# Altium project EECE8010_Template.PrjPcb
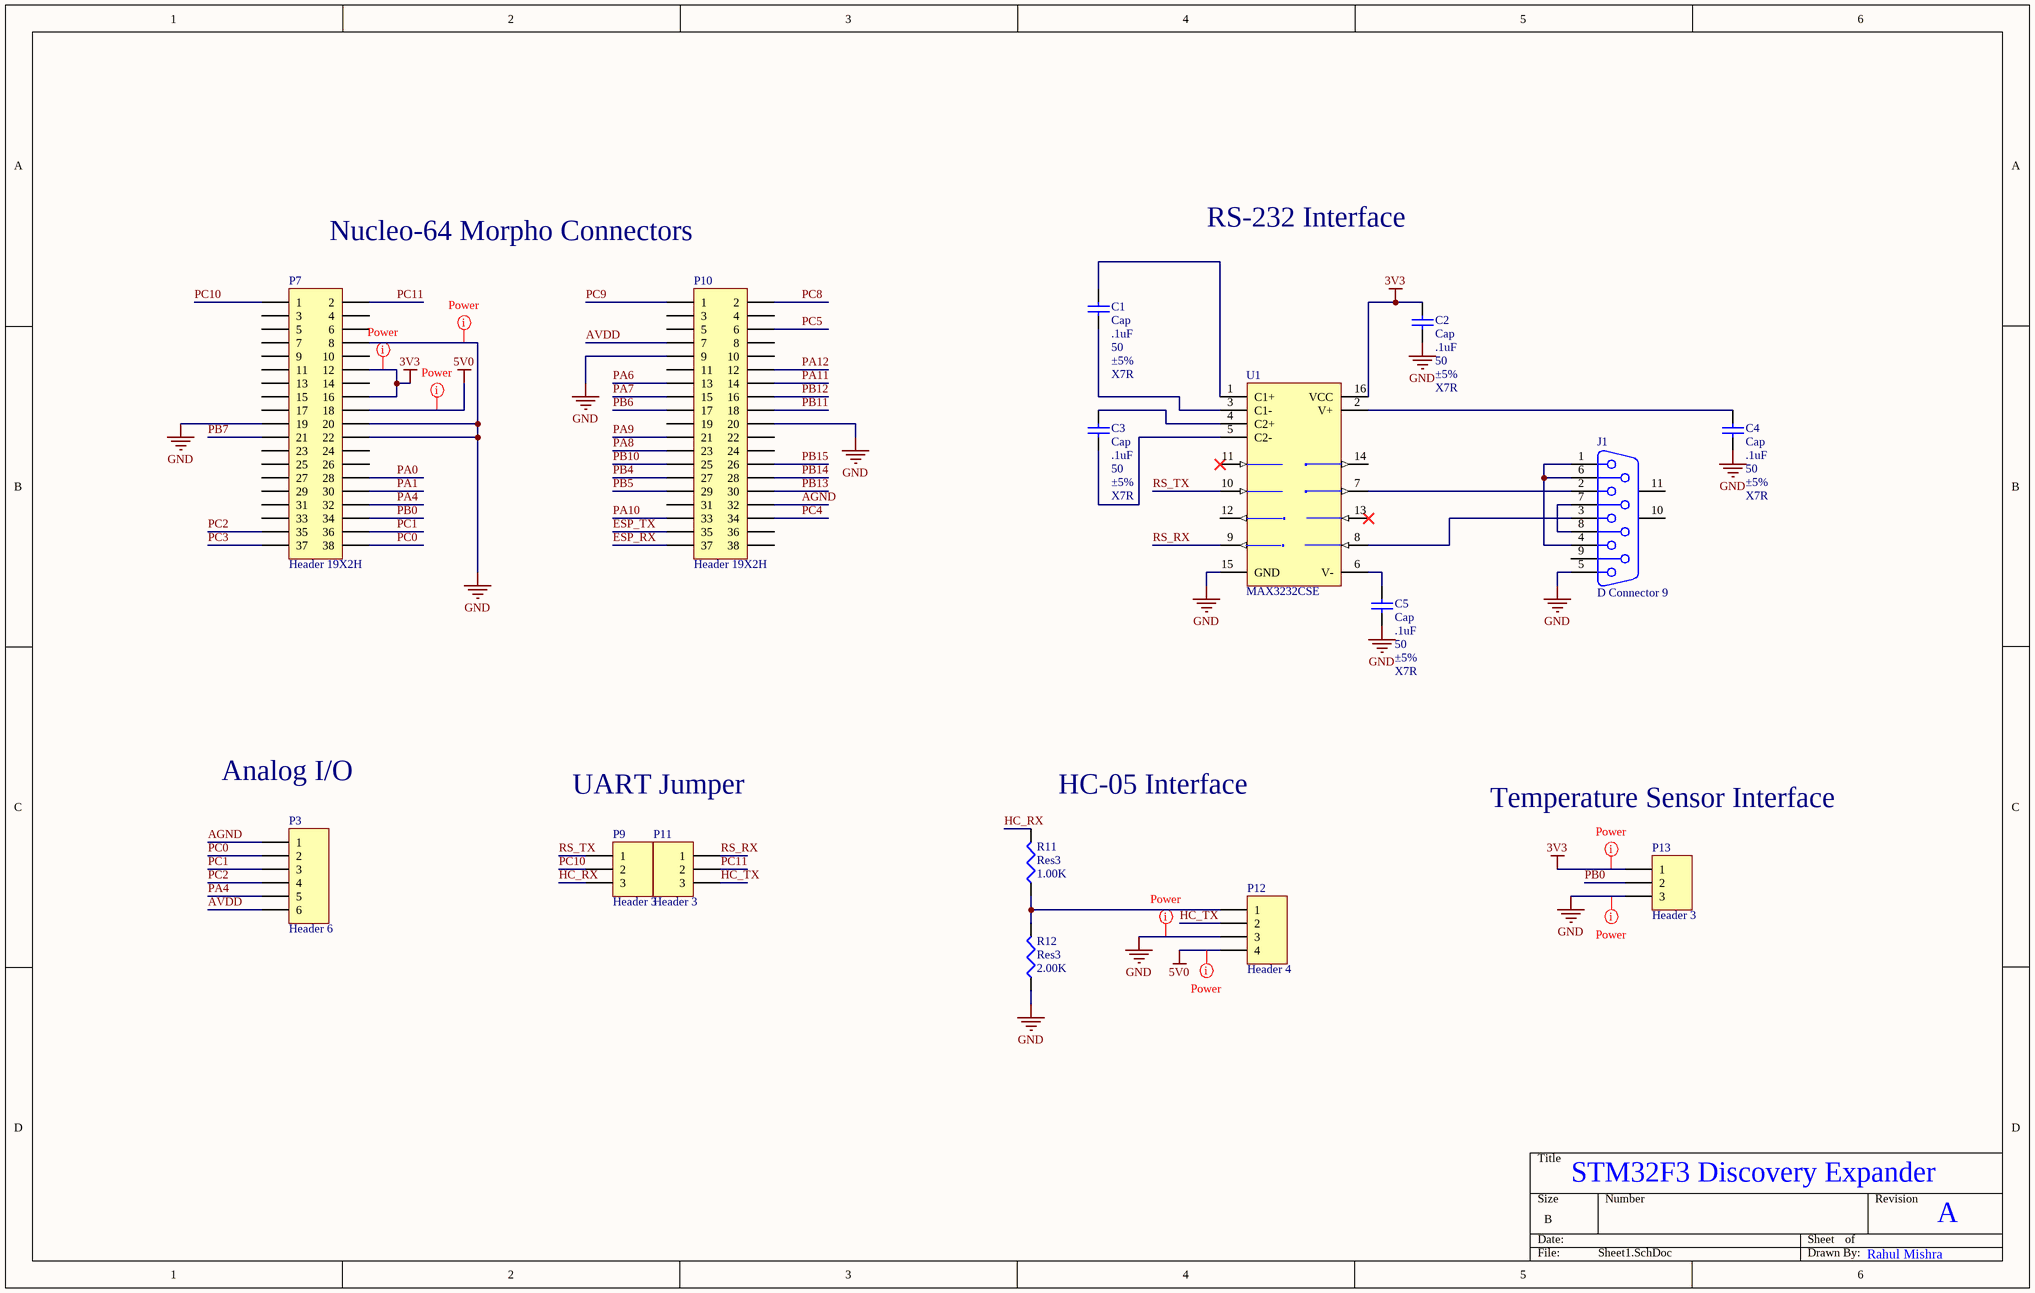
[diagram p0: Sheet1.SchDoc]
4 sheets, 55 parts. Net scope: global (net labels, ports and power ports of the same name join across sheets).
Board file: Template.PcbDoc
Sheets:
  Sheet1.SchDoc
  Sheet2.SchDoc
  Sheet3.SchDoc
  Mechanical.SchDoc

## Sheet Sheet1.SchDoc
size B

### Parts
C1  Cap  value .1uF  WV: 50  Tolerance: ±5%  Type: X7R  [CAPC2012X09M]
C2  Cap  value .1uF  WV: 50  Tolerance: ±5%  Type: X7R  [CAPC2012X09M]
C3  Cap  value .1uF  WV: 50  Tolerance: ±5%  Type: X7R  [CAPC2012X09M]
C4  Cap  value .1uF  WV: 50  Tolerance: ±5%  Type: X7R  [CAPC2012X09M]
C5  Cap  value .1uF  WV: 50  Tolerance: ±5%  Type: X7R  [CAPC2012X09M]
J1  D Connector 9  [DSUB1.385-2H9]
P3  Header 6  [HDR1X6]
P7  Header 19X2H  [PPPC192LFBN-RC]
P9  Header 3  [HDR1X3]
P10  Header 19X2H  [PPPC192LFBN-RC]
P11  Header 3  [HDR1X3]
P12  Header 4  [HDR1X4]
P13  Header 3  [HDR1X3]
R11  Res3  value 1.00K  [RESC2112X05M]
R12  Res3  value 2.00K  [RESC2112X05M]
U1  MAX3232CSE  [NSO16_N]

### Nets
3V3: C2.2 P7.12 P7.16 P13.1 U1.16(VCC)
5V0: P7.18 P12.4
GND: C2.1 C4.1 C5.1 J1.5 P7.8 P7.19 P7.20 P7.22 P10.9 P10.20 P12.3 P13.3 R12.1 U1.15(GND)
AGND: P3.1 P10.32
AVDD: P3.6 P10.7
ESP_RX: P10.37
ESP_TX: P10.35
HC_RX: P9.3 R11.2
HC_TX: P11.3 P12.2
PA0: P7.28
PA1: P7.30
PA4: P3.5 P7.32
PA6: P10.13
PA7: P10.15
PA8: P10.23
PA9: P10.21
PA10: P10.33
PA11: P10.14
PA12: P10.12
PB0: P7.34 P13.2
PB4: P10.27
PB5: P10.29
PB6: P10.17
PB7: P7.21
PB10: P10.25
PB11: P10.18
PB12: P10.16
PB13: P10.30
PB14: P10.28
PB15: P10.26
PC0: P3.2 P7.38
PC1: P3.3 P7.36
PC2: P3.4 P7.35
PC3: P7.37
PC4: P10.34
PC5: P10.6
PC8: P10.2
PC9: P10.1
PC10: P7.1 P9.2
PC11: P7.2 P11.2
RS_RX: P11.1 U1.9(R2OUT)
RS_TX: P9.1 U1.10(T2IN)
NetC1_1: C1.1 U1.3(C1-)
NetC1_2: C1.2 U1.1(C1+)
NetC3_1: C3.1 U1.5(C2-)
NetC3_2: C3.2 U1.4(C2+)
NetC4_2: C4.2 U1.2(V+)
NetC5_2: C5.2 U1.6(V-)
NetJ1_1: J1.1 J1.4 J1.6
NetJ1_2: J1.2 U1.7(T2OUT)
NetJ1_3: J1.3 U1.8(R2IN)
NetJ1_7: J1.7 J1.8
NetP12_1: P12.1 R11.1 R12.2

Not connected (* = marked no-connect by the designer): J1 9 10(MH1) 11(MH2); P7 3 4 5 6 7 9 10 11 13 14 15 17 23 24 25 26 27 29 31 33; P10 3 4 5 8 10 11 19 22 24 31 36 38; U1 11(T1IN)* 12(R1OUT) 13(R1IN)* 14(T1OUT)

### Layout directives
net class Power: 3V3, 5V0, GND

### Notes on the sheet
- RS-232 Interface
- Nucleo-64 Morpho Connectors
- Analog I/O
- UART Jumper
- (near R11) HC-05 Interface
- Temperature Sensor Interface
- STM32F3 Discovery Expander
- A
- Rahul Mishra

### Library data of the parts
C1-C5 = CAP-X7R-.1uF-50V-±5%: CAP CER .1uF 50v X7R 0805; MPN: C0805C104J5RACTU; PN: 399-1171-1-ND; Name: CAP-X7R-.1uF-50V-±5%; URL: http://www.digikey.ca/product-detail/en/C0805C104J5RACTU/399-1171-1-ND
J1 = D Connector 9: Receptacle Assembly, 9 Position, Right Angle; MPN: ADF09A-KG-TASB3-R; PN: AE10921-ND; URL: http://www.digikey.ca/product-detail/en/ADF09A-KG-TASB3-R/AE10921-ND
P3 = Header 6: Header, 6-Pin Male; MPN: PEC06SFAN; PN: S1212E-06-ND; URL: http://www.digikey.ca/product-detail/en/PEC06SFAN/S1212E-06-ND
P7 P10 = Header 19X2H: 38 Position Header Connector 0.100in (2.54mm) Through Hole Gold; PN: S7122-ND; URL: https://www.digikey.ca/product-detail/en/sullins-connector-solutions/PPPC192LFBN-RC/S7122-ND; MPN: PPPC192LFBN-RC
P9 P11 P13 = Header 3: Header, 3-Pin Male; MPN: PEC03SFAN; PN: S1212E-03-ND; URL: http://www.digikey.ca/product-detail/en/PEC03SFAN/S1212E-03-ND
P12 = Header 4: Header, 4-Pin Male; MPN: PEC04SFAN; PN: S1212E-04-ND; URL: http://www.digikey.ca/product-detail/en/PEC04SFAN/S1212E-04-ND
R11 = Resistor_1.00K: RES SMD 1.00K OHM 1% 1/8W 0805; MPN: CRCW08051K00FKEA; PN: 541-1.00KCCT-ND; Name: Resistor_1.00K; URL: http://www.digikey.ca/product-detail/en/CRCW08051K00FKEA/541-1.00KCCT-ND
R12 = Resistor_2.00K: RES SMD 2.00K OHM 1% 1/8W 0805; MPN: CRCW08052K00FKEA; PN: 541-2.00KCCT-ND; Name: Resistor_2.00K; URL: http://www.digikey.ca/product-detail/en/CRCW08052K00FKEA/541-2.00KCCT-ND
U1 = MAX3232CSE: 3.0V TO 5.5V, Low-Power, up to 1Mbps, True RS-232 Transceiver Using Four 0.1µF External Capacitor; MPN: MAX3232CSE+; PN: MAX3232CSE+-ND; Published: 16-Jan-2001; LatestRevisionDate: 13-Apr-2006; LatestRevisionNote: IPC-7351 Footprint Added.; DatasheetVersion: Mar-1999; PackageReference: NSO16; Publisher: Altium Limited; PackageDescription: 16-Pin Small Outline Integrated Circuit 1.27 mm Pitch; Code_JEDEC: MS-012-AC; Code_IPC: SOIC127P600-16; ComponentLink1Description: Manufacturer Link; ComponentLink1URL: http://www.maxim-ic.com/; ComponentLink2Description: Datasheet; ComponentLink2URL: http://pdfserv.maxim-ic.com/en/ds/MAX3222-MAX3241.pdf; URL: http://www.digikey.ca/product-detail/en/MAX3232CSE%2B/MAX3232CSE%2B-ND

## Sheet Sheet2.SchDoc
size B
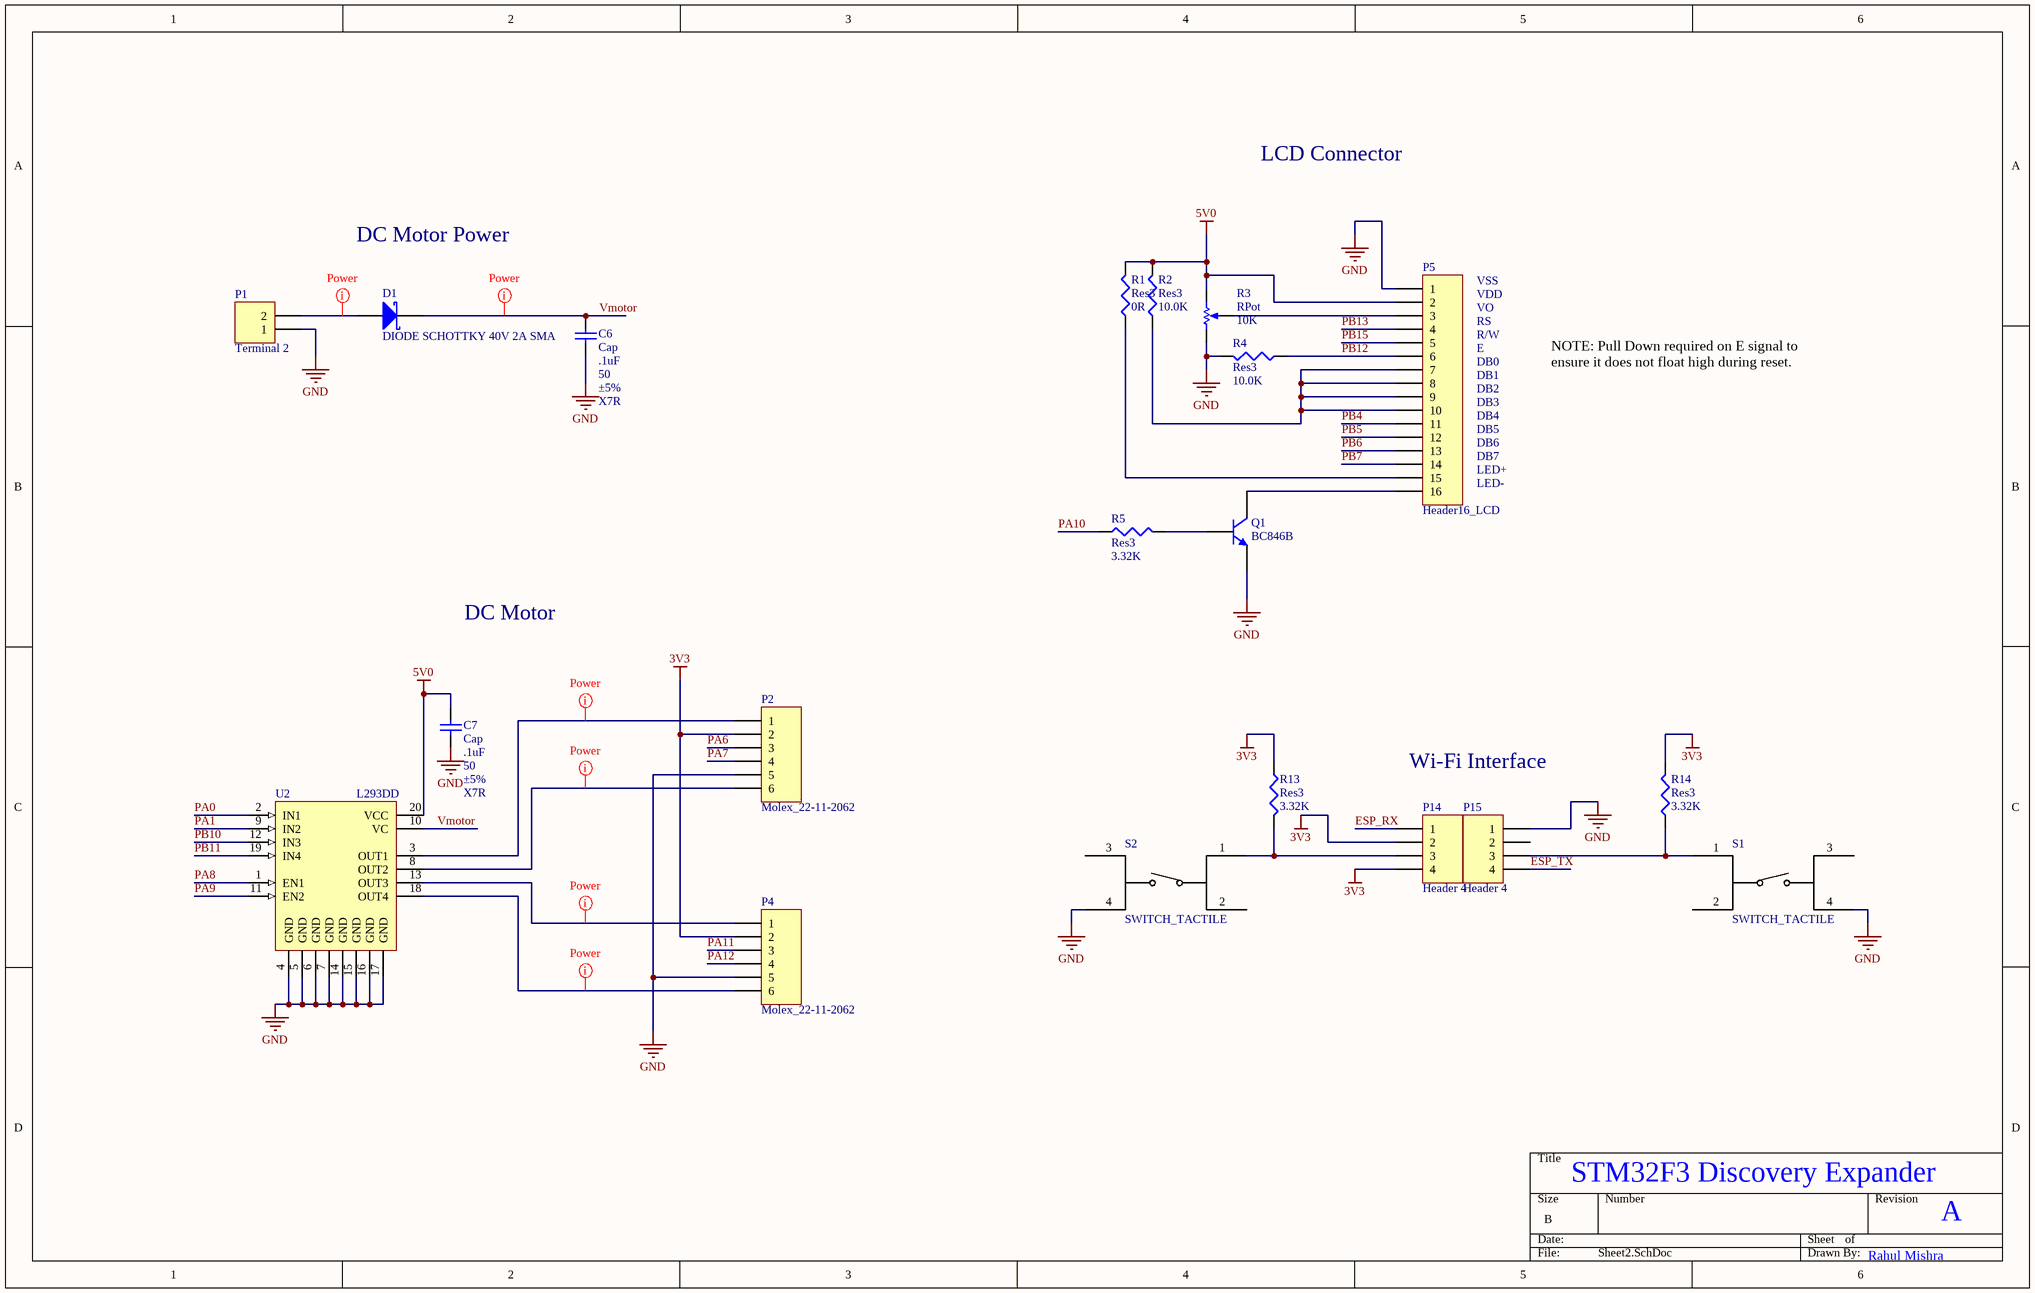
[diagram p1: Sheet2.SchDoc]

### Parts
C6  Cap  value .1uF  WV: 50  Tolerance: ±5%  Type: X7R  [CAPC2012X09M]
C7  Cap  value .1uF  WV: 50  Tolerance: ±5%  Type: X7R  [CAPC2012X09M]
D1  DIODE SCHOTTKY 40V 2A SMA  [DIOM4326X23M]
P1  Terminal 2  [TYCO_282841_2]
P2  Molex_22-11-2062  [MOLEX_22-11-2062]
P4  Molex_22-11-2062  [MOLEX_22-11-2062]
P5  Header16_LCD  [HDR1X16_LCD]
P14  Header 4  [HDR1X4]
P15  Header 4  [HDR1X4]
Q1  BC846B  [SOT95P230X110-3M]
R1  Res3  value 0R  [RESC2112X05M]
R2  Res3  value 10.0K  [RESC2112X05M]
R3  RPot  value 10K  [BOURNS_3386F]
R4  Res3  value 10.0K  [RESC2112X05M]
R5  Res3  value 3.32K  [RESC2112X05M]
R13  Res3  value 3.32K  [RESC2112X05M]
R14  Res3  value 3.32K  [RESC2112X05M]
S1  SWITCH_TACTILE  [TACT_SWITCH_6MM_SMT]
S2  SWITCH_TACTILE  [TACT_SWITCH_6MM_SMT]
U2  L293DD  [SO20_N]

### Nets
3V3: P2.2 P4.2 P14.2 P14.4 R13.2 R14.2
5V0: C7.2 P5.2 R1.2 R2.2 R3.3(BOT) U2.20(VCC)
GND: C6.1 C7.1 P1.1 P2.5 P4.5 P5.1 P15.1 Q1.2(E) R3.1(TOP) R4.2 S1.4 S2.4 U2.4(GND) U2.5(GND) U2.6(GND) U2.7(GND) U2.14(GND) U2.15(GND) U2.16(GND) U2.17(GND)
ESP_RX: P14.1
ESP_TX: P15.4
PA0: U2.2(IN1)
PA1: U2.9(IN2)
PA6: P2.3
PA7: P2.4
PA8: U2.1(EN1)
PA9: U2.11(EN2)
PA10: R5.1
PA11: P4.3
PA12: P4.4
PB4: P5.11
PB5: P5.12
PB6: P5.13
PB7: P5.14
PB10: U2.12(IN3)
PB11: U2.19(IN4)
PB12: P5.6 R4.1
PB13: P5.4
PB15: P5.5
Vmotor: C6.2 D1.1(K) U2.10(VC)
NetD1_2: D1.2(A) P1.2
NetP2_1: P2.1 U2.3(OUT1)
NetP2_6: P2.6 U2.8(OUT2)
NetP4_1: P4.1 U2.13(OUT3)
NetP4_6: P4.6 U2.18(OUT4)
NetP5_3: P5.3 R3.2(TAP)
NetP5_7: P5.7 P5.8 P5.9 P5.10 R2.1
NetP5_15: P5.15 R1.1
NetP5_16: P5.16 Q1.3(C)
NetP14_3: P14.3 R13.1 S2.1
NetP15_3: P15.3 R14.1 S1.1
NetQ1_1: Q1.1(B) R5.2

Not connected (* = marked no-connect by the designer): P15 2; S1 2 3; S2 2 3

### Layout directives
net class Power: NetD1_2, NetP2_1, NetP2_6, NetP4_1, NetP4_6, Vmotor

### Notes on the sheet
- LCD Connector
- DC Motor Power
- VSS
- VDD
- VO
- RS
- R/W
- E
- DB0
- DB1
- DB2
- DB3
- DB4
- DB5
- NOTE: Pull Down required on E signal to ensure it does not float high during reset.
- DB6
- DB7
- LED+
- LED-
- DC Motor
- Wi-Fi Interface
- STM32F3 Discovery Expander
- A
- Rahul Mishra

### Library data of the parts
C6 C7 = CAP-X7R-.1uF-50V-±5%: as C1 on sheet Sheet1; Name: CAP-X7R-.1uF-50V-±5%; URL: http://www.digikey.ca/product-detail/en/C0805C104J5RACTU/399-1171-1-ND
D1 = DIODE SCHOTTKY 40V 2A SMA: Schottky Rectifier; MPN: B240A-13-F; PN: B240A-FDICT-ND; URL: http://www.digikey.ca/product-detail/en/B240A-13-F/B240A-FDICT-ND
P1 = Terminal 2: Terminal, 2-Pin; MPN: 282841-2; PN: A98342-ND; LatestRevisionDate: 17-Jul-2002; LatestRevisionNote: Re-released for DXP Platform.; Publisher: Altium Limited; URL: http://www.digikey.ca/product-detail/en/282841-2/A98342-ND/1136740
P2 P4 = Molex_22-11-2062: CONN HEADER 6POS .100 VERT GOLD; MPN: 0022112062; PN: WM2704-ND; URL: http://www.digikey.ca/product-detail/en/0022112062/WM2704-ND
P5 = Header16_LCD: Header, 16-Pin Female; MPN: PPPC161LFBN-RC; PN: S7049-ND; URL: http://www.digikey.ca/product-detail/en/PPPC161LFBN-RC/S7049-ND
P14 P15 = Header 4: as P12 on sheet Sheet1; URL: http://www.digikey.ca/product-detail/en/PEC04SFAN/S1212E-04-ND
Q1 = BC846B: TRANS NPN 65V 0.1A SOT23; MPN: BC846BLT3G; PN: BC846BLT3GOSCT-ND; URL: https://www.digikey.ca/product-detail/en/on-semiconductor/BC846BLT3G/BC846BLT3GOSCT-ND
R1 = Resistor_0R_Jumper: RES SMD 0 OHM 5% 1/8W 0805; MPN: CRCW08050000Z0EA; PN: 541-0.0ACT-ND; Name: Resistor_0R_Jumper; URL: http://www.digikey.ca/product-detail/en/CRCW08050000Z0EA/541-0.0ACT-ND
R2 R4 = Resistor_10.0K: RES SMD 10.0K OHM 1% 1/8W 0805; MPN: CRCW080510K0FKEA; PN: 541-10.0KCCT-ND; Name: Resistor_10.0K; URL: http://www.digikey.ca/product-detail/en/CRCW080510K0FKEA/541-10.0KCCT-ND
R3 = RPot: POT 10K OHM THUMBWHEEL CERM ST; MPN: 3352T-1-103LF; Sim Note: Enter the Resistance value and the set point into parameter fields.; Set Position: 0.5; PN: 3352T-103LF-ND; Published: 8-Jun-2000; LatestRevisionDate: 17-Jul-2002; LatestRevisionNote: Re-released for DXP Platform.; PackageReference: VR5; Publisher: Altium Limited; PackageDescription: Variable Resistor, Thru-Hole; 3 Leads; URL: http://www.digikey.ca/product-detail/en/3352T-1-103LF/3352T-103LF-ND
R5 R13 R14 = Resistor_3.32K: RES SMD 3.32K OHM 1% 1/8W 0805; MPN: CRCW08053K32FKEA; PN: 541-3.32KCCT-ND; Name: Resistor_3.32K; URL: http://www.digikey.ca/product-detail/en/CRCW08053K32FKEA/541-3.32KCCT-ND
S1 S2 = SWITCH_TACTILE: SWITCH TACTILE SPST-NO 0.05A 12V; MPN: PTS645SH50SMTR92 LFS; PN: CKN9085CT-ND; URL: http://www.digikey.ca/product-detail/en/PTS645SH50SMTR92%20LFS/CKN9085CT-ND
U2 = L293DD: IC MOTOR DRIVER PAR 20-SOIC; MPN: L293DD013TR; PN: 497-2937-1-ND; Published: 8-Jun-2000; LatestRevisionDate: 13-Apr-2006; LatestRevisionNote: IPC-7351 Footprint Added.; DatasheetVersion: Jun-1996; PackageVersion: Jul-2001; PackageReference: SO20; Publisher: Altium Limited; PackageDescription: 20-Pin Plastic Small Outline Integrated Circuit 1.27 mm Pitch; Code_JEDEC: MS-013-AC; Code_IPC: SOIC127P1030-20; ComponentLink1Description: Manufacturer Link; ComponentLink1URL: http://www.st.com/; ComponentLink2Description: Datasheet; ComponentLink2URL: http://www.st.com/stonline/products/literature/ds/1330/l293d.pdf; URL: http://www.digikey.ca/product-detail/en/L293DD013TR/497-2937-1-ND

## Sheet Sheet3.SchDoc
size B
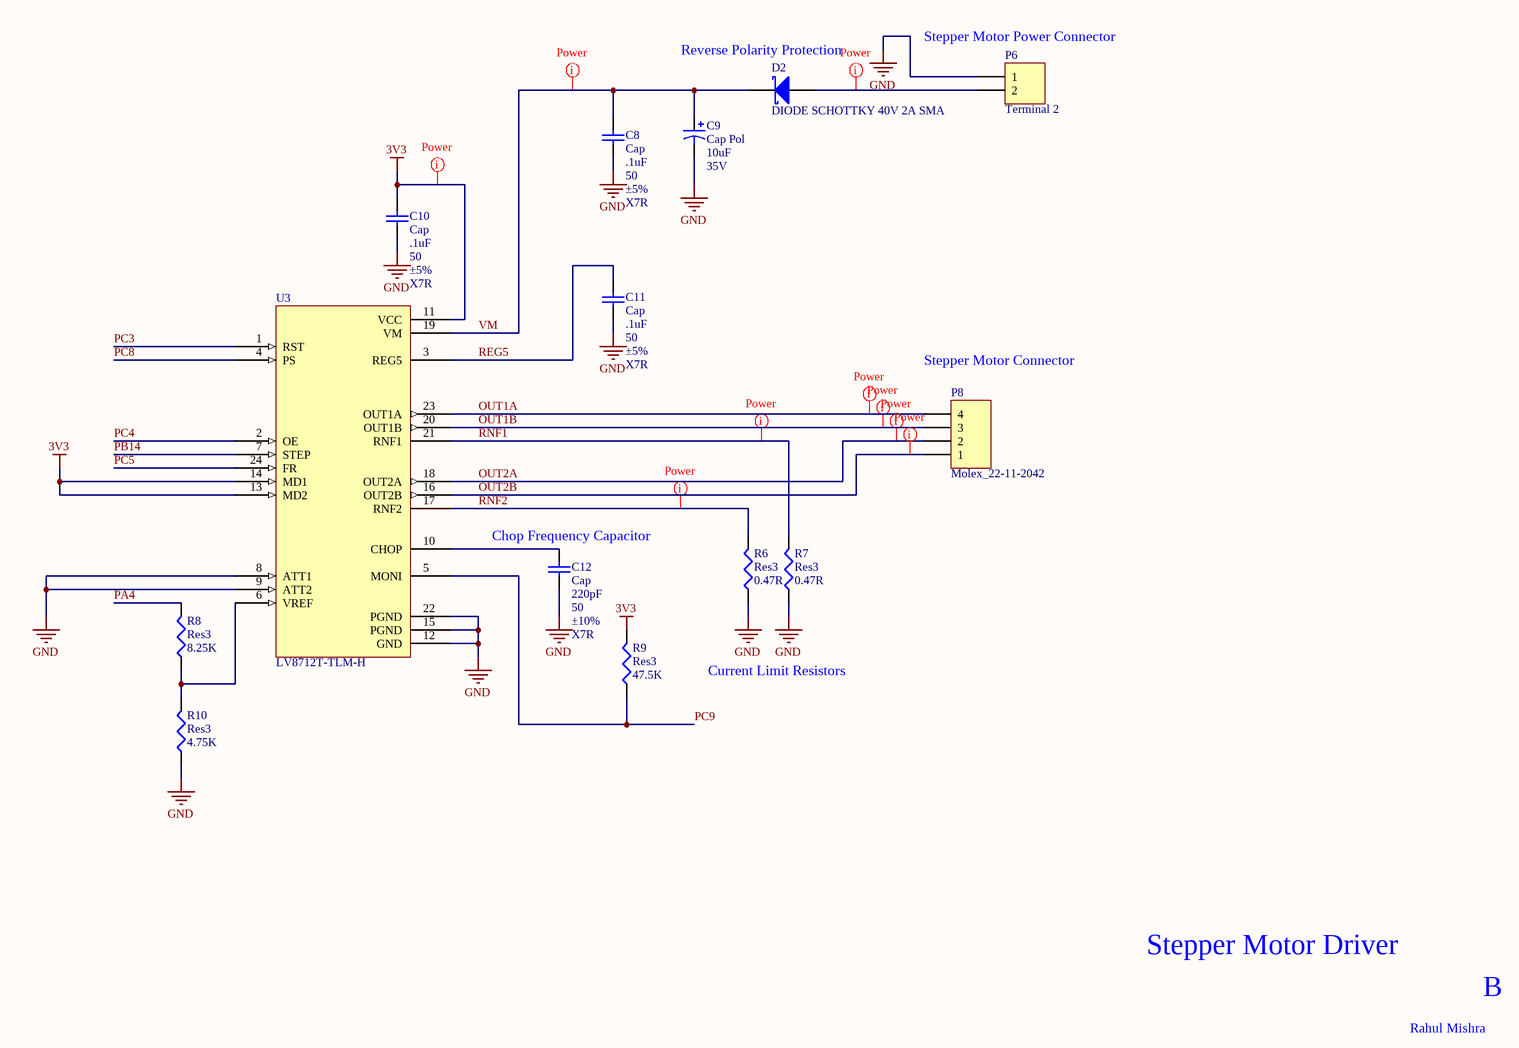
[diagram p2: Sheet3.SchDoc]

### Parts
C8  Cap  value .1uF  WV: 50  Tolerance: ±5%  Type: X7R  [CAPC2012X09M]
C9  Cap Pol  value 10uF  Voltage: 35V  [CAPACITOR_5MM]
C10  Cap  value .1uF  WV: 50  Tolerance: ±5%  Type: X7R  [CAPC2012X09M]
C11  Cap  value .1uF  WV: 50  Tolerance: ±5%  Type: X7R  [CAPC2012X09M]
C12  Cap  value 220pF  WV: 50  Tolerance: ±10%  Type: X7R  [CAPC2012X09M]
D2  DIODE SCHOTTKY 40V 2A SMA  [DIOM4326X23M]
P6  Terminal 2  [TYCO_282841_2]
P8  Molex_22-11-2042  [MOLEX-22-11-2042]
R6  Res3  value 0.47R  [RESC3125X07M]
R7  Res3  value 0.47R  [RESC3125X07M]
R8  Res3  value 8.25K  [RESC2112X05M]
R9  Res3  value 47.5K  [RESC2112X05M]
R10  Res3  value 4.75K  [RESC2112X05M]
U3  LV8712T-TLM-H  [ONSEMITSSOP50P640X120-24M]

### Nets
3V3: C10.2 R9.2 U3.11(VCC) U3.13(MD2) U3.14(MD1)
GND: C8.1 C9.2 C10.1 C11.1 C12.1 P6.1 R6.1 R7.1 R10.1 U3.8(ATT1) U3.9(ATT2) U3.12(GND) U3.15(PGND) U3.22(PGND)
OUT1A: P8.4 U3.23(OUT1A)
OUT1B: P8.3 U3.20(OUT1B)
OUT2A: P8.2 U3.18(OUT2A)
OUT2B: P8.1 U3.16(OUT2B)
PA4: R8.2
PB14: U3.7(STEP)
PC3: U3.1(RST)
PC4: U3.2(OE)
PC5: U3.24(FR)
PC8: U3.4(PS)
PC9: R9.1 U3.5(MONI)
REG5: C11.2 U3.3(REG5)
RNF1: R7.2 U3.21(RNF1)
RNF2: R6.2 U3.17(RNF2)
VM: C8.2 C9.1 D2.1(K) U3.19(VM)
NetC12_2: C12.2 U3.10(CHOP)
NetD2_2: D2.2(A) P6.2
NetR8_1: R8.1 R10.2 U3.6(VREF)

### Layout directives
net class Power: 3V3, NetD2_2, OUT1A, OUT1B, OUT2A, OUT2B, RNF1, RNF2, VM

### Notes on the sheet
- (near D2) Reverse Polarity Protection
- (near P6) Stepper Motor Power Connector
- (near P8) Stepper Motor Connector
- (near C12) Chop Frequency Capacitor
- Current Limit Resistors
- Stepper Motor Driver
- B
- Rahul Mishra

### Library data of the parts
C8 C10 C11 = CAP-X7R-.1uF-50V-±5%: as C1 on sheet Sheet1; Name: CAP-X7R-.1uF-50V-±5%; URL: http://www.digikey.ca/product-detail/en/C0805C104J5RACTU/399-1171-1-ND
C9 = Cap Polar-10uF-35V: CAP 85C 10uF ±20% 35V WX Series Aluminum Electrolytic; MPN: UWX1V100MCL1GB; Tan Theta: 0.12; Leakage Current: 3.5; Rated Ripple Current: 29; PN: 493-2117-1-ND; Name: Cap Polar-10uF-35V; Diameter: 5; URL: http://www.digikey.ca/product-detail/en/UWX1V100MCL1GB/493-2117-1-ND
C12 = CAP-X7R-220pF-50V-±10%: CAP CER 220pF 50v X7R 0805; MPN: C0805C221K5RACTU; PN: 399-1138-1-ND; Name: CAP-X7R-220pF-50V-±10%; URL: http://www.digikey.ca/product-detail/en/C0805C221K5RACTU/399-1138-1-ND
D2 = DIODE SCHOTTKY 40V 2A SMA: as D1 on sheet Sheet2; URL: http://www.digikey.ca/product-detail/en/B240A-13-F/B240A-FDICT-ND
P6 = Terminal 2: as P1 on sheet Sheet2; LatestRevisionDate: 17-Jul-2002; LatestRevisionNote: Re-released for DXP Platform.; Publisher: Altium Limited; URL: http://www.digikey.ca/product-detail/en/282841-2/A98342-ND/1136740
P8 = Molex_22-11-2042: CONN HEADER 4POS .100 VERT GOLD; MPN: 0022112042; PN: WM2702-ND; URL: http://www.digikey.ca/product-detail/en/0022112042/WM2702-ND
R6 R7 = Resistor_0.47R_1W: RES SMD 0.47OHM 5% 1W 1210; MPN: RCWE1210R470FKEA; PN: RCWE.47FCT-ND; Name: Resistor_0.47R_1W; URL: http://www.digikey.ca/product-detail/en/vishay-dale/RCWE1210R470FKEA/RCWE.47FCT-ND
R8 = Resistor_8.25K: RES SMD 8.25K OHM 1% 1/8W 0805; MPN: CRCW08058K25FKEA; PN: 541-8.25KCCT-ND; Name: Resistor_8.25K; URL: http://www.digikey.ca/product-detail/en/CRCW08058K25FKEA/541-8.25KCCT-ND
R9 = Resistor_47.5K: RES SMD 47.5K OHM 1% 1/8W 0805; MPN: CRCW080547K5FKEA; PN: 541-47.5KCCT-ND; Name: Resistor_47.5K; URL: http://www.digikey.ca/product-detail/en/CRCW080547K5FKEA/541-47.5KCCT-ND
R10 = Resistor_4.75K: RES SMD 4.75K OHM 1% 1/8W 0805; MPN: CRCW08054K75FKEA; PN: 541-4.75KCCT-ND; Name: Resistor_4.75K; URL: http://www.digikey.ca/product-detail/en/CRCW08054K75FKEA/541-4.75KCCT-ND
U3 = LV8712T-TLM-H: IC MOTOR DRIVER PAR 24TSSOP; PN: 869-1290-1-ND; URL: http://www.digikey.ca/product-detail/en/on-semiconductor/LV8712T-TLM-H/869-1290-1-ND; MPN: LV8712T-TLM-H

## Sheet Mechanical.SchDoc
size A4
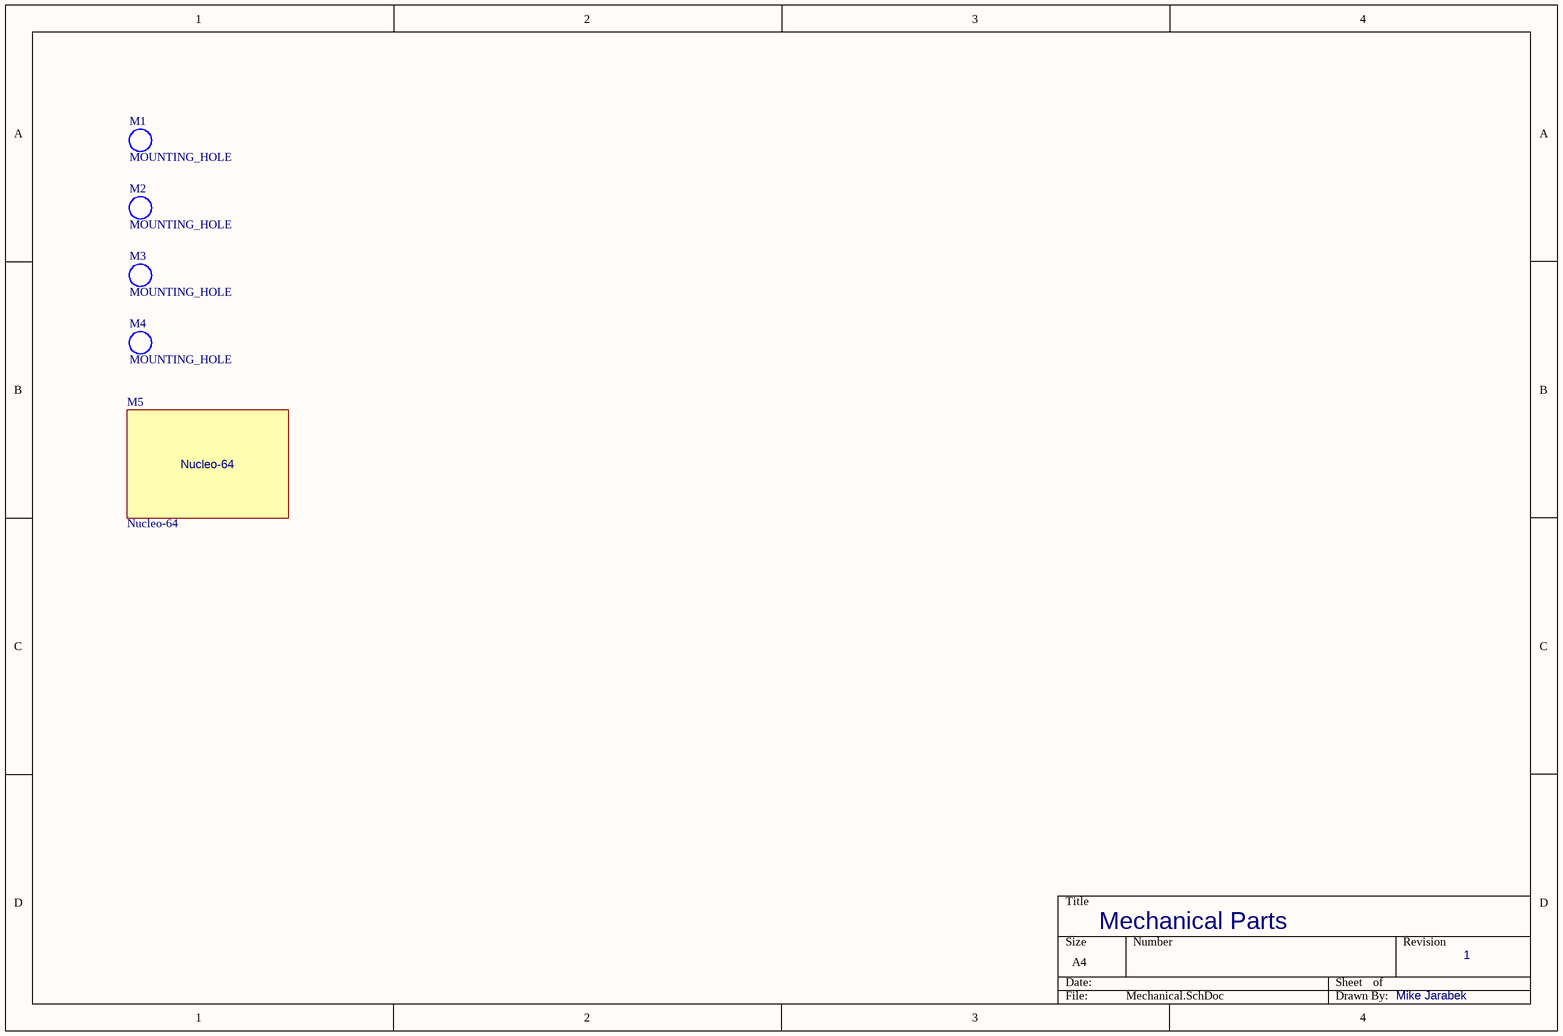
[diagram p3: Mechanical.SchDoc]

### Parts
M1  MOUNTING_HOLE  [MOUNTING_HOLE]
M2  MOUNTING_HOLE  [MOUNTING_HOLE]
M3  MOUNTING_HOLE  [MOUNTING_HOLE]
M4  MOUNTING_HOLE  [MOUNTING_HOLE]
M5  Nucleo-64  [NUCLEO_64]

### Notes on the sheet
- Mechanical Parts
- 1
- Mike Jarabek

### Library data of the parts
M1-M4 = MOUNTING_HOLE: Mounting Hole
M5 = Nucleo-64: Nucleo-64 Board Model

## Nets that join several sheets
3V3: Sheet1 (5 pins), Sheet2 (6 pins), Sheet3 (5 pins)
5V0: Sheet1 (P7.18 P12.4), Sheet2 (6 pins)
GND: Sheet1 (14 pins), Sheet2 (20 pins), Sheet3 (14 pins)
ESP_RX: Sheet1 (P10.37), Sheet2 (P14.1)
ESP_TX: Sheet1 (P10.35), Sheet2 (P15.4)
PA0: Sheet1 (P7.28), Sheet2 (U2.2)
PA1: Sheet1 (P7.30), Sheet2 (U2.9)
PA4: Sheet1 (P3.5 P7.32), Sheet3 (R8.2)
PA6: Sheet1 (P10.13), Sheet2 (P2.3)
PA7: Sheet1 (P10.15), Sheet2 (P2.4)
PA8: Sheet1 (P10.23), Sheet2 (U2.1)
PA9: Sheet1 (P10.21), Sheet2 (U2.11)
PA10: Sheet1 (P10.33), Sheet2 (R5.1)
PA11: Sheet1 (P10.14), Sheet2 (P4.3)
PA12: Sheet1 (P10.12), Sheet2 (P4.4)
PB4: Sheet1 (P10.27), Sheet2 (P5.11)
PB5: Sheet1 (P10.29), Sheet2 (P5.12)
PB6: Sheet1 (P10.17), Sheet2 (P5.13)
PB7: Sheet1 (P7.21), Sheet2 (P5.14)
PB10: Sheet1 (P10.25), Sheet2 (U2.12)
PB11: Sheet1 (P10.18), Sheet2 (U2.19)
PB12: Sheet1 (P10.16), Sheet2 (P5.6 R4.1)
PB13: Sheet1 (P10.30), Sheet2 (P5.4)
PB14: Sheet1 (P10.28), Sheet3 (U3.7)
PB15: Sheet1 (P10.26), Sheet2 (P5.5)
PC3: Sheet1 (P7.37), Sheet3 (U3.1)
PC4: Sheet1 (P10.34), Sheet3 (U3.2)
PC5: Sheet1 (P10.6), Sheet3 (U3.24)
PC8: Sheet1 (P10.2), Sheet3 (U3.4)
PC9: Sheet1 (P10.1), Sheet3 (R9.1 U3.5)